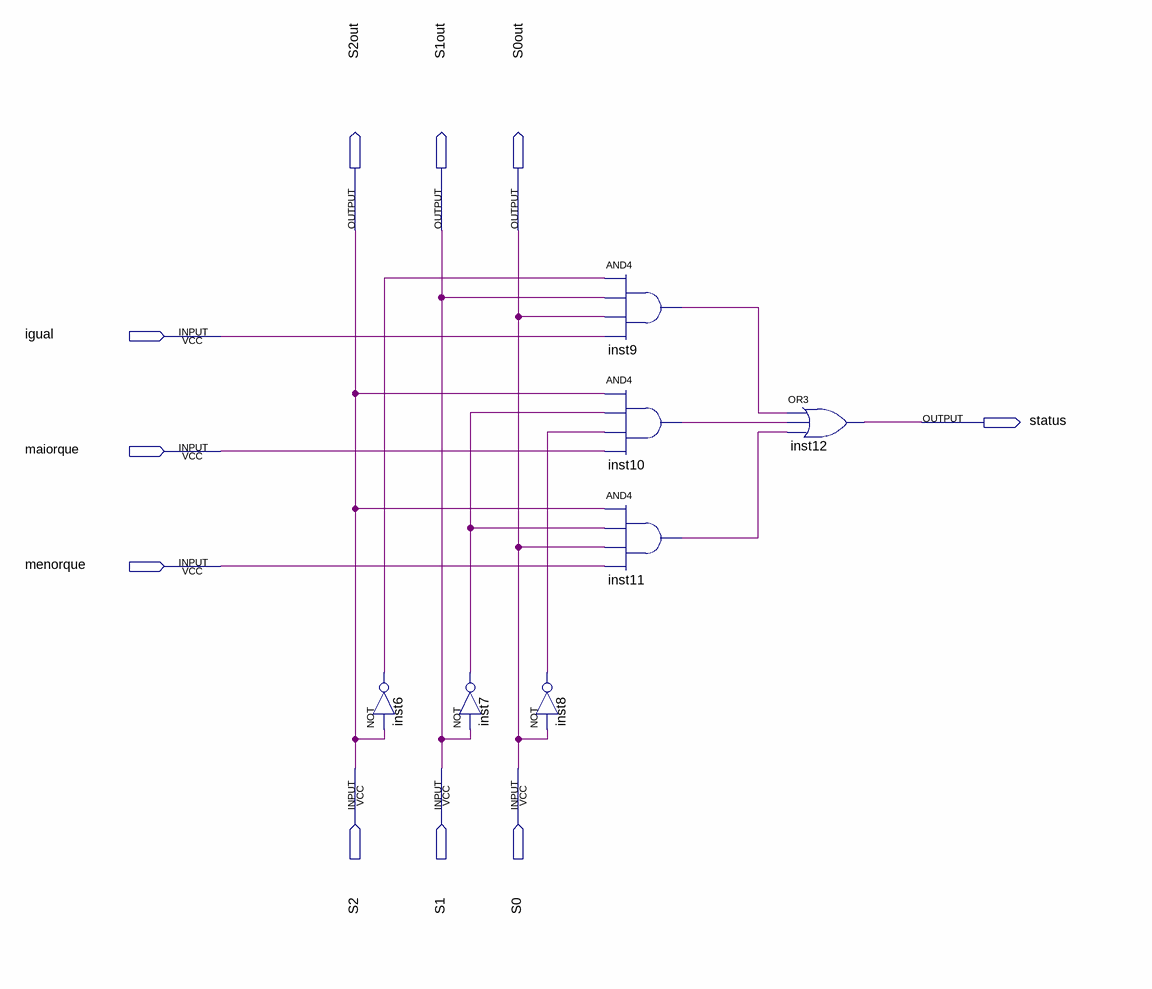
[diagram p0: schematic sheet]
// Quartus schematic muxStatus.bdf as structural Verilog: 7 symbols, 10 pins
module muxStatus (
  input  igual,
  input  maiorque,
  input  menorque,
  input  S2,
  input  S1,
  input  S0,
  output S2out,
  output S1out,
  output S0out,
  output status
);

  wire inst6_out, inst7_out, inst8_out, inst9_out, inst10_out, inst11_out;

  not inst6 (inst6_out, S2);
  not inst7 (inst7_out, S1);
  not inst8 (inst8_out, S0);
  and inst9 (inst9_out, inst6_out, S1, S0, igual);
  and inst10 (inst10_out, S2, inst7_out, inst8_out, maiorque);
  and inst11 (inst11_out, S2, inst7_out, S0, menorque);
  or inst12 (status, inst9_out, inst10_out, inst11_out);

  assign S0out = S0;
  assign S1out = S1;
  assign S2out = S2;
endmodule
